# EAGLE design udemy_course (EAGLE 9.6.2)
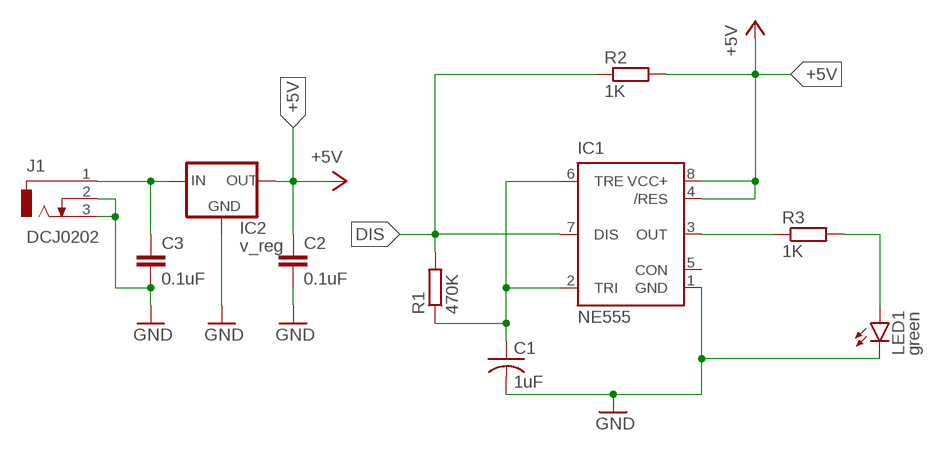
[diagram p0: schematic, sheet 1]

## Parts
C1  1uF  C-US050-045X075  [C050-045X075]
C2  0.1uF  C-EU025-050X050  [C025-050X050]
C3  0.1uF  C-EU025-050X050  [C025-050X050]
IC1  NE555  [DIL-08]
IC2  v_reg  78XXS  [78XXS]
J1  DCJ0202  [DCJ0202]
LED1  green  LED5MM  [LED5MM]
R1  470K  R-EU_0411/15  [0411/15]
R2  1K  R-EU_0411/15  [0411/15]
R3  1K  R-EU_0411/15  [0411/15]

## Nets
+5V: C2.1 IC1.4(/RES) IC1.8(VCC+) IC2.OUT R2.2
DIS: IC1.7(DIS) R1.2 R2.1
GND: C1.2 C2.2 C3.2 IC1.1(GND) IC2.GND J1.2 J1.3 LED1.K(C)
N$1: C3.1 IC2.IN J1.1
N$2: IC1.3(OUT) R3.1
N$3: LED1.A R3.2
N$5: C1.1 IC1.2(TRI) IC1.6(TRE) R1.1
Unconnected: IC1.5(CON)

## Library data of the parts
C1 = rcl:C-US: CAPACITOR, American symbol; SPICEPREFIX: C
C2 C3 = rcl:C-EU: CAPACITOR, European symbol; SPICEPREFIX: C
IC1 = st-microelectronics:NE555: General purpose bipolar Timer; MF: Arrow Electronics; MPN: NE555N; OC_FARNELL: 1467742; OC_NEWARK: 89K1486
IC2 = v-reg:78XXS: VOLTAGE REGULATOR
J1 = con-jack:DCJ0202: DC POWER JACK Source: DCJ0202.pdf; OC_FARNELL: unknown; OC_NEWARK: unknown
LED1 = led:LED: LED OSRAM: - CHIPLED LG R971, LG N971, LY N971, LG Q971, LY Q971, LO R971, LY R971 LH N974, LH R974 LS Q976, LO Q976, LY Q976 LO Q996 - Hyper CHIPLED LW Q18S LB Q993, LB Q99A, LB R99A - SideLED LS A670, LO A670, LY A670, LG A670, LP A670 LB A673, LV A673, LT A673, LW A673 LH A674 LY A675 LS A676, LA A676, LO A676, LY A676, LW A676 LS A679, LY A679, LG A679 - Hyper Micro SIDELED® LS Y876, LA Y876, LO Y876, LY Y876 LT Y87S - SmartLED LW L88C, LW L88S LB L89C, LB L89S, LG L890 LS L89K, LO L89K, LY L89K LS L896, LA L896, LO L896, LY L896 - TOPLED LS T670, LO T670, LY T670, LG T670, LP T670 LSG T670, LSP T670, LSY T670, LOP T670, LYG T670 LG T671, LOG T671, LSG T671 LB T673, LV T673, LT T673, LW T673 LH T674 LS T676, LA T676, LO T676, LY T676, LB T676, LH T676, LSB T676, LW T676 LB T67C, LV T67C, LT T67C, LS T67K, LO T67K, LY T67K, LW E67C LS E67B, LA E67B, LO E67B, LY E67B, LB E67C, LV E67C, LT E67C LW T67C LS T679, LY T679, LG T679 LS T770, LO T770, LY T770, LG T770, LP T770 LB T773, LV T773, LT T773, LW T773 LH T774 LS E675, LA E675, LY E675, LS T675 LS T776, LA T776, LO T776, LY T776, LB T776 LHGB T686 LT T68C, LB T68C - Hyper Mini TOPLED® LB M676 - Mini TOPLED Santana® LG M470 LS M47K, LO M47K, LY M47K Source: http://www.osram.convergy.de LUXEON: - LUMILED® LXK2-PW12-R00, LXK2-PW12-S00, LXK2-PW14-U00, LXK2-PW14-V00 LXK2-PM12-R00, LXK2-PM12-S00, LXK2-PM14-U00 LXK2-PE12-Q00, LXK2-PE12-R00, LXK2-PE12-S00, LXK2-PE14-T00, LXK2-PE14-U00 LXK2-PB12-K00, LXK2-PB12-L00, LXK2-PB12-M00, LXK2-PB14-N00, LXK2-PB14-P00, LXK2-PB14-Q00 LXK2-PR12-L00, LXK2-PR12-M00, LXK2-PR14-Q00, LXK2-PR14-R00 LXK2-PD12-Q00, LXK2-PD12-R00, LXK2-PD12-S00 LXK2-PH12-R00, LXK2-PH12-S00 LXK2-PL12-P00, LXK2-PL12-Q00, LXK2-PL12-R00 Source: www.luxeon.com KINGBRIGHT: KA-3528ASYC Source: www.kingbright.com
R1-R3 = rcl:R-EU_: RESISTOR, European symbol; SPICEPREFIX: R

## Board
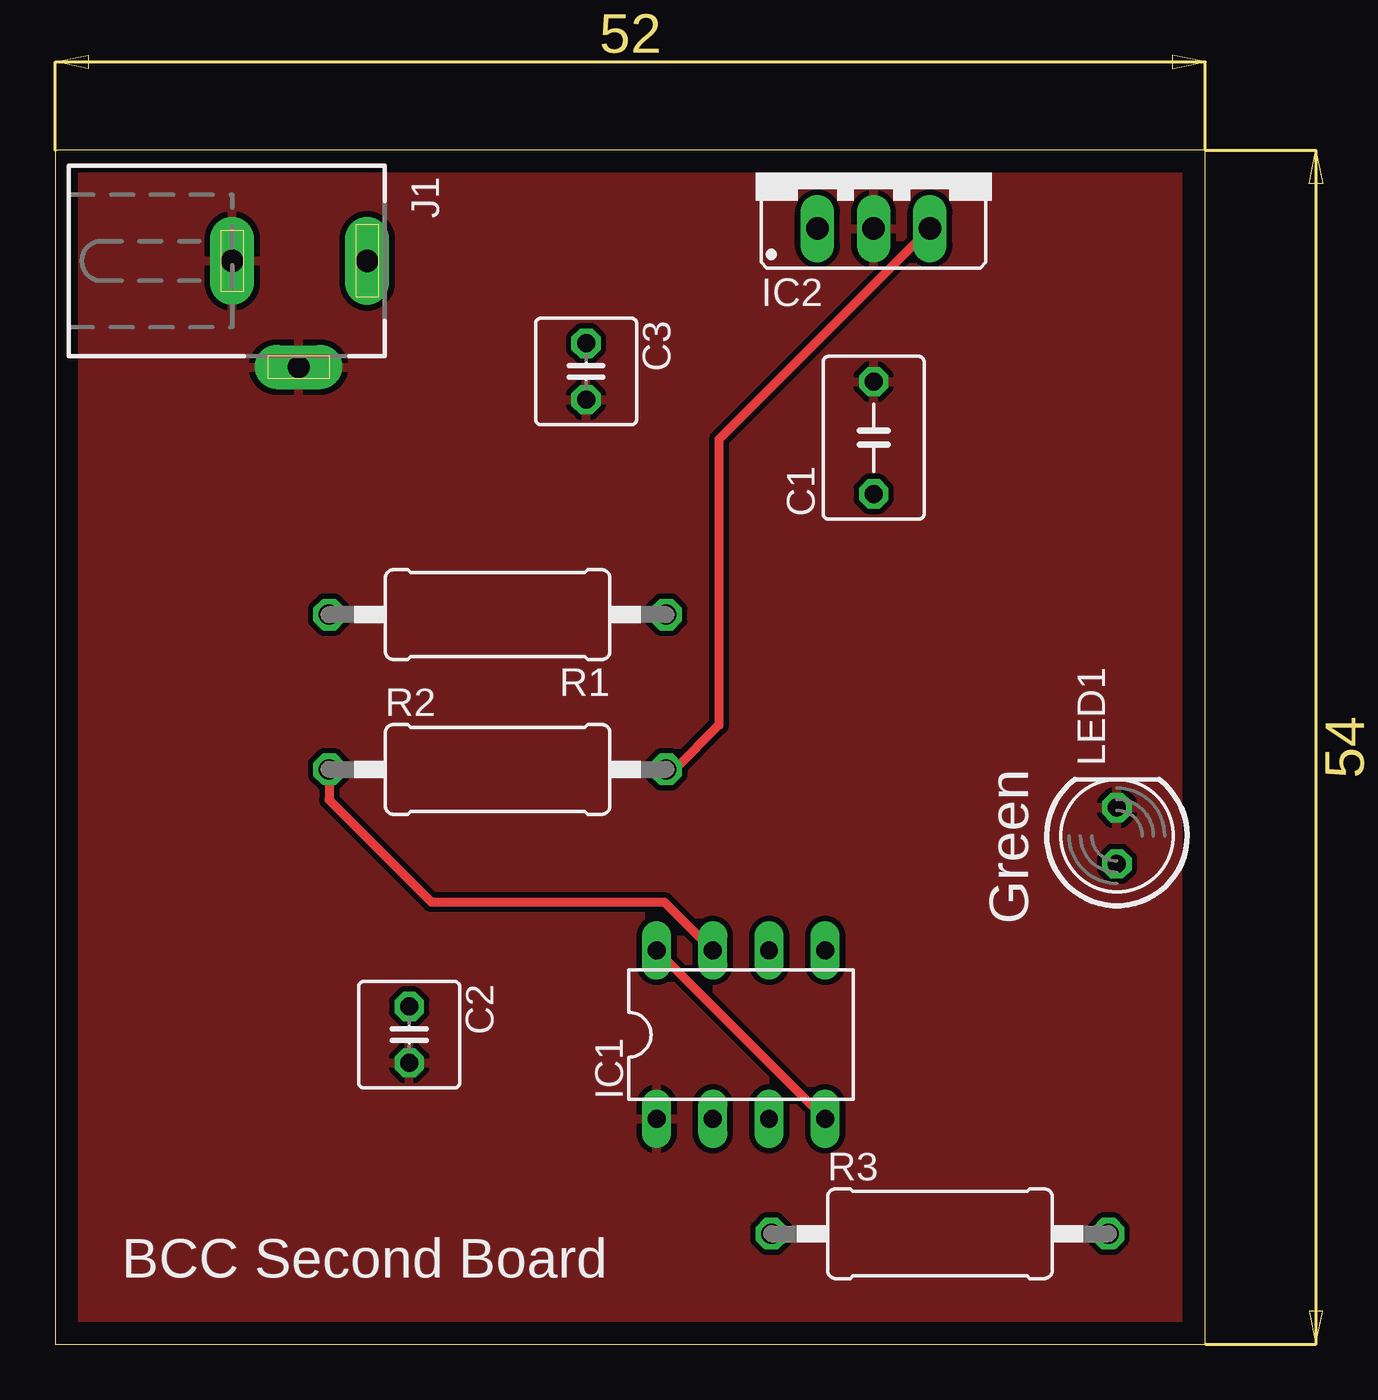
[diagram p1: board, top side]
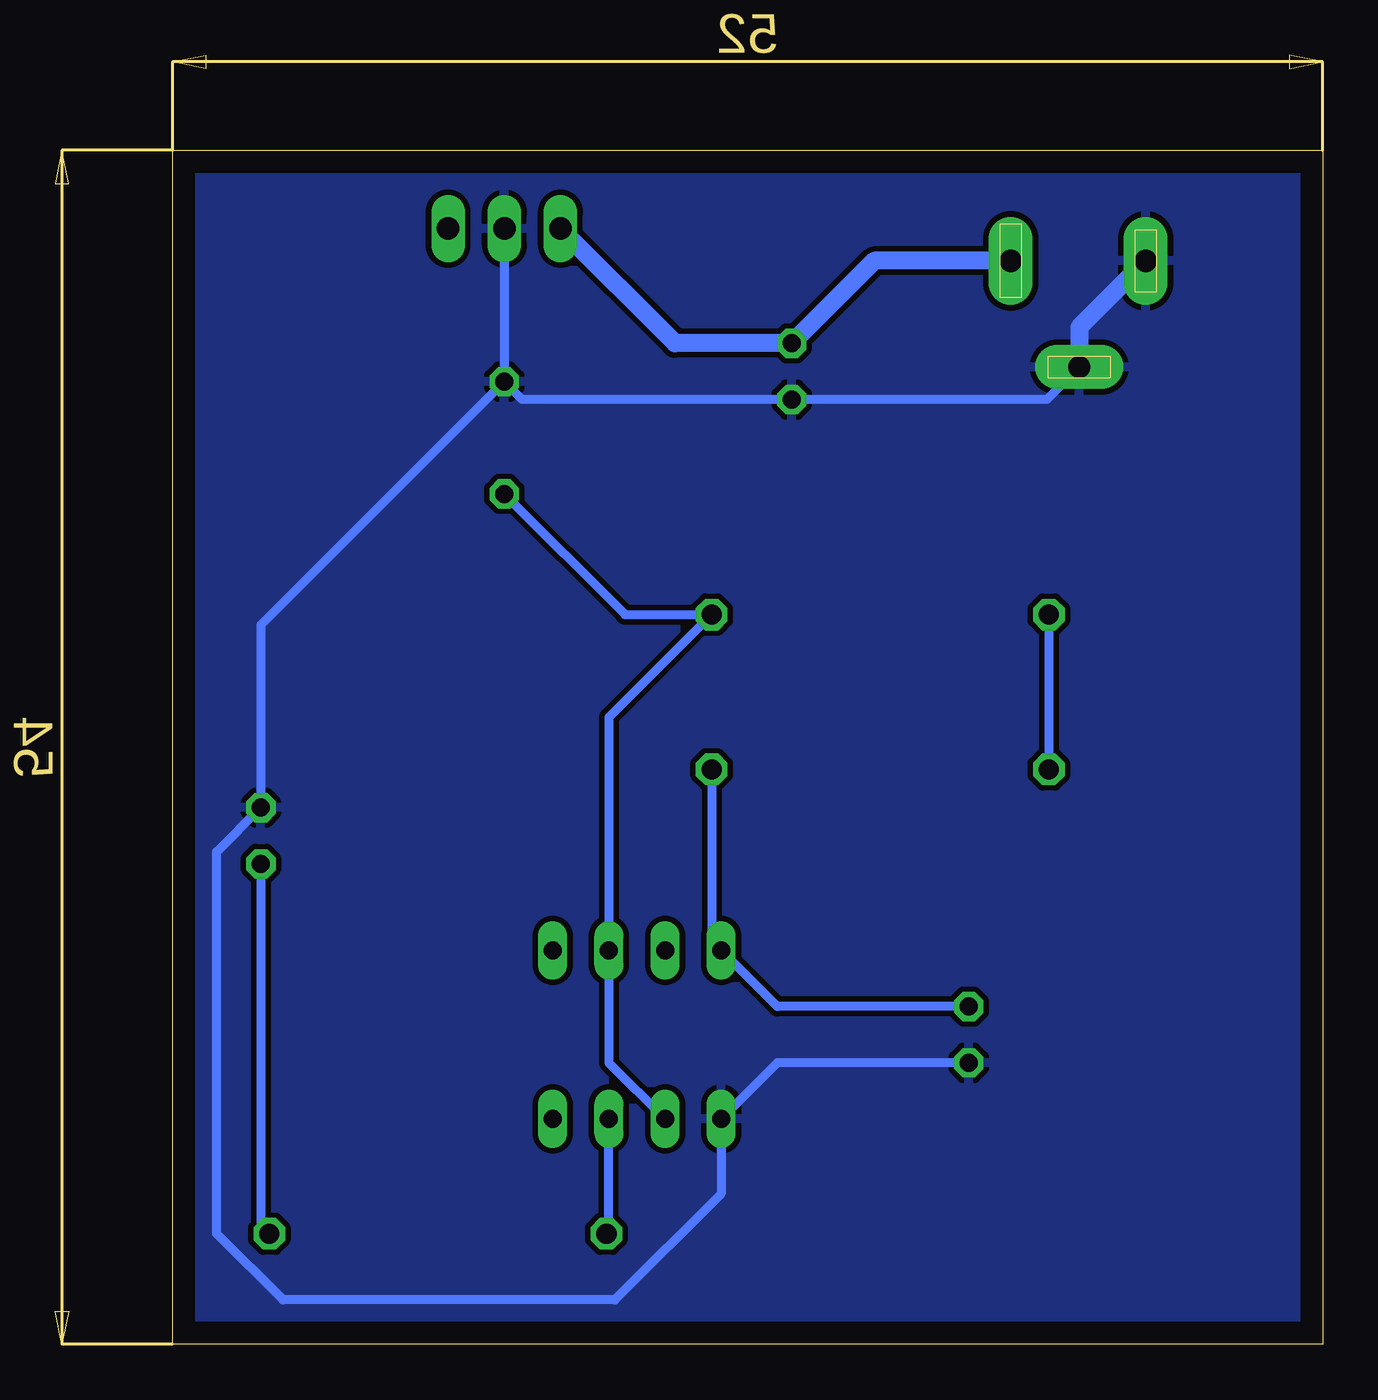
[diagram p2: board, bottom side, seen from below]

Size 52 x 54 mm. Coordinates in mm from the lower left corner, seen from the top.
Outline: 0,0 52,0 52,54 0,54 0,0
Copper layers (1*16): Top 0.035mm / dielectric 1.5mm / Bottom 0.035mm
Design rules "default *": minimum track width 6mil, minimum drill 0.35mm, track to track 10mil, track to pad 10mil, pad to pad 10mil, via to via 10mil, smd to smd 6mil, copper to edge 40mil, drill to drill 6mil, minimum pad ring 10mil, minimum via ring 8mil, stop-mask expansion 4mil, vias tented up to drill 0mil, thermal gap 10mil

### Footprints (pad centres in the part's own frame; a part is rotated, then mirrored left to right if it is on the bottom)
C050-045X075 = drill 0.813 octagon: 1 -2.54,0; 2 2.54,0
C025-050X050 = drill 0.813 octagon: 1 -1.27,0; 2 1.27,0
DIL-08 = drill 0.813 long: 1 -3.81,-3.81; 2 -1.27,-3.81; 3 1.27,-3.81; 4 3.81,-3.81; 5 3.81,3.81; 6 1.27,3.81; 7 -1.27,3.81; 8 -3.81,3.81
78XXS = drill 1.016 long: GND 0,-2.54; IN -2.54,-2.54; OUT 2.54,-2.54
DCJ0202 = drill 1 pad 2 long: 1 0,3.1; 2 4.8,0; 3 0,-3
LED5MM = drill 0.813 octagon: A -1.27,0; K 1.27,0
0411/15 = drill 0.914 octagon: 1 -7.62,0; 2 7.62,0

### Placement (x,y rotation side)
C1  37,41 90 top
C2  16,14 270 top
C3  24,44 270 top
IC1  31,14 0 top
IC2  37,53 0 top
J1  11,49 270 top
LED1  48,23 90 top
R1  20,33 180 top
R2  20,26 0 top
R3  40,5 0 top

### Tracks (layer width: path | path; a pad name or v marks a point on that pad's centre or on a via)
+5V
  Top 0.406: IC2.OUT 30,40.92 30,28 28,26 R2.2 | IC1.8 IC1.4
  Bottom 0.406: C2.1 24.65,15.27 IC1.8 27.62,18.24 R2.2
DIS
  Top 0.406: R2.1 12.38,24.62 17,20 27.54,20 IC1.7
  Bottom 0.406: R1.2 R2.1
GND
  Bottom 0.406: J1.2 12.47,42.73 C3.2 36.19,42.73 C1.2 | C2.2 24.65,12.73 IC1.1 27.19,6.81 32,2 47,2 50,5 50,22.27 LED1.K 48,32.54 C1.2 | IC2.GND C1.2
  Bottom 0.813: J1.3 11,46 J1.2
  pour Bottom: 0,54 52,54 52,0 0,0
  pour Top: 0,54 52,54 52,0 0,0
N$1
  Bottom 0.813: J1.1 20.27,49 C3.1 29.27,45.27 IC2.IN
N$2
  Bottom 0.406: R3.1 32.27,5.11 IC1.3
N$3
  Bottom 0.406: LED1.A 48,5.38 R3.2
N$5
  Bottom 0.406: C1.1 31.54,33 R1.1 32.27,28.35 IC1.6 32.27,12.73 IC1.2

### Text on the board
tNames: Green | BCC Second Board